# EAGLE design QFN48_ESP32-D0WD-V3_EXP.pac (EAGLE 9.6.2)
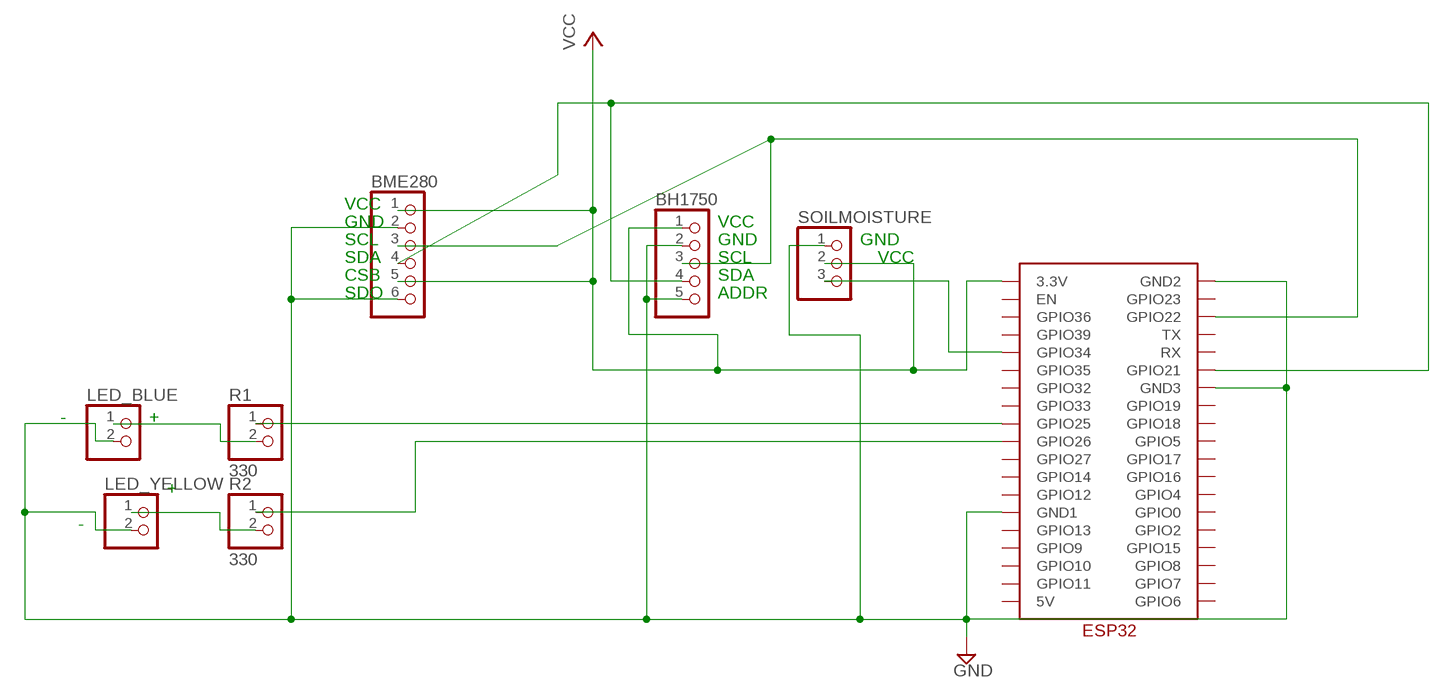
[diagram p0: schematic, sheet 1]

## Parts
BH1750  PINHD-1X5/90  [1X05/90]
BME280  PINHD-1X6/90  [1X06/90]
LED_BLUE  PINHD-1X2/90  [1X02/90]
LED_YELLOW  PINHD-1X2/90  [1X02/90]
R1  330  PINHD-1X2/90  [1X02/90]
R2  330  PINHD-1X2/90  [1X02/90]
SOILMOISTURE  PINHD-1X3/90  [1X03/90]
U$1  ESP32  [ESP32]

## Nets
3V3: BH1750.1 BME280.1 BME280.5 SOILMOISTURE.2 U$1.3.3V ; supply symbol labelled VCC
GND: BH1750.2 BH1750.5 BME280.2 BME280.6 LED_BLUE.2 LED_YELLOW.2 SOILMOISTURE.1 U$1.GND1 U$1.GND2 U$1.GND3
N$1: R1.1 U$1.GPIO25
N$2: LED_BLUE.1 R1.2
N$3: LED_YELLOW.1 R2.2
N$4: R2.1 U$1.GPIO26
SCL: BH1750.3 BME280.3 U$1.GPIO22
SDA: BH1750.4 BME280.4 U$1.GPIO21
SOIL_SIG: SOILMOISTURE.3 U$1.GPIO34
Unconnected: U$1.5V U$1.EN U$1.GPIO0 U$1.GPIO2 U$1.GPIO4 U$1.GPIO5 U$1.GPIO6 U$1.GPIO7 U$1.GPIO8 U$1.GPIO9 U$1.GPIO10 U$1.GPIO11 U$1.GPIO12 U$1.GPIO13 U$1.GPIO14 U$1.GPIO15 U$1.GPIO16 U$1.GPIO17 U$1.GPIO18 U$1.GPIO19 U$1.GPIO23 U$1.GPIO27 U$1.GPIO32 U$1.GPIO33 U$1.GPIO35 U$1.GPIO36 U$1.GPIO39 U$1.RX U$1.TX

## Notes on the sheet
- VCC
- GND | VCC
- SCL | GND | GND
- SDA | SCL | VCC
- CSB | SDA
- SDO | ADDR
- - | +
- +
- -

## Library data of the parts
BH1750 = pinhead:PINHD-1X5: PIN HEADER
BME280 = pinhead:PINHD-1X6: PIN HEADER
LED_BLUE LED_YELLOW R1 R2 = pinhead:PINHD-1X2: PIN HEADER
SOILMOISTURE = pinhead:PINHD-1X3: PIN HEADER
U$1 = ESP32:ESP32

## Net classes
0 default: width 0.305 mm, drill 0.508 mm, clearance 0.254 mm

## Board
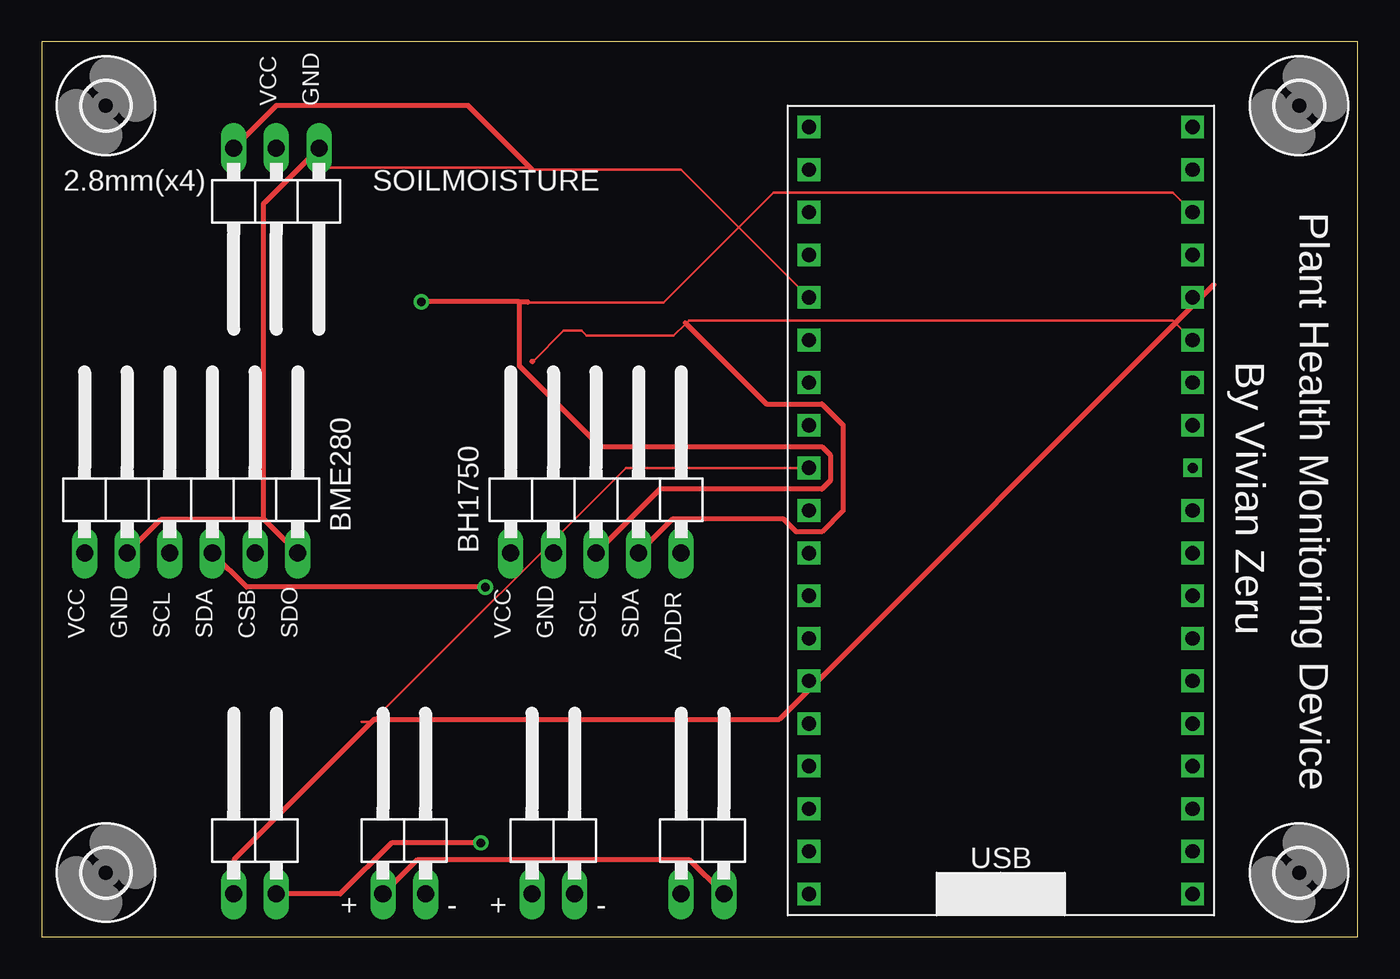
[diagram p1: board, top side]
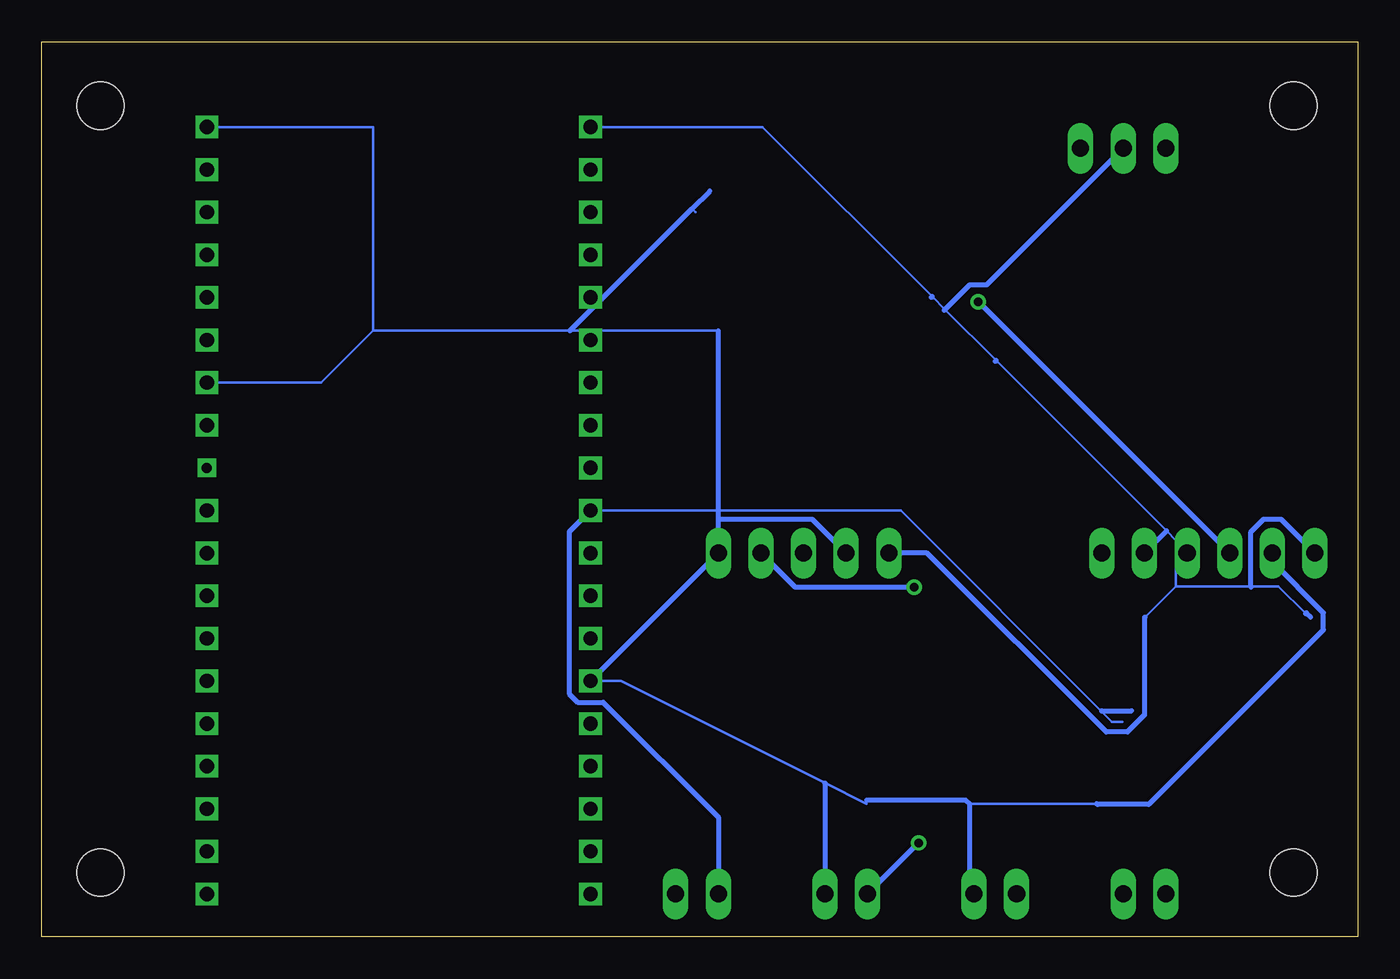
[diagram p2: board, bottom side, seen from below]

Size 78.41 x 53.33 mm. Coordinates in mm from the lower left corner, seen from the top.
Outline: 0,0 78.41,0 78.41,53.33 0,53.33 0,0
Copper layers (1*16): Top 0.035mm / dielectric 1.5mm / Bottom 0.035mm
Design rules "default": minimum track width 6mil, minimum drill 0.35mm, track to track 6mil, track to pad 6mil, pad to pad 6mil, via to via 6mil, smd to smd 6mil, copper to edge 40mil, drill to drill 6mil, minimum pad ring 10mil, minimum via ring 8mil, stop-mask expansion 4mil, vias tented up to drill 0mil, thermal gap 10mil

### Footprints (pad centres in the part's own frame; a part is rotated, then mirrored left to right if it is on the bottom)
1X05/90 = drill 1.016 long: 1 -5.08,-3.81; 2 -2.54,-3.81; 3 0,-3.81; 4 2.54,-3.81; 5 5.08,-3.81
1X06/90 = drill 1.016 long: 1 -6.35,-3.81; 2 -3.81,-3.81; 3 -1.27,-3.81; 4 1.27,-3.81; 5 3.81,-3.81; 6 6.35,-3.81
1X02/90 = drill 1.016 long: 1 -1.27,-3.81; 2 1.27,-3.81
1X03/90 = drill 1.016 long: 1 -2.54,-3.81; 2 0,-3.81; 3 2.54,-3.81
ESP32 = drill 0.85 square: 3.3V 1.27,46.99; 5V 1.27,1.27; EN 1.27,44.45; GND1 1.27,13.97; GND2 24.13,46.99; GND3 24.13,31.75; GPIO0 24.13,13.97; GPIO2 24.13,11.43; GPIO4 24.13,16.51; GPIO5 24.13,24.13; GPIO6 24.13,1.27; GPIO7 24.13,3.81; GPIO8 24.13,6.35; GPIO9 1.27,8.89; GPIO10 1.27,6.35; GPIO11 1.27,3.81; GPIO12 1.27,16.51; GPIO13 1.27,11.43; GPIO14 1.27,19.05; GPIO15 24.13,8.89; GPIO16 24.13,19.05; GPIO17 24.13,21.59; GPIO19 24.13,29.21; GPIO21 24.13,34.29; GPIO22 24.13,41.91; GPIO23 24.13,44.45; GPIO25 1.27,26.67; GPIO26 1.27,24.13; GPIO27 1.27,21.59; GPIO32 1.27,31.75; GPIO33 1.27,29.21; GPIO34 1.27,36.83; GPIO35 1.27,34.29; GPIO36 1.27,41.91; GPIO39 1.27,39.37; RX 24.13,36.83; TX 24.13,39.37 | drill 0.6 square: GPIO18 24.13,26.67
2,8 = hole 2.8: 0,0

### Placement (x,y rotation side)
BH1750  33.02,26.67 0 top
BME280  8.89,26.67 0 top
LED_BLUE  30.48,6.35 0 top
LED_YELLOW  21.59,6.35 0 top
R1  12.7,6.35 0 top
R2  39.37,6.35 0 top
SOILMOISTURE  13.97,43.18 180 top
U$1  44.45,1.27 0 top
U$2  [2,8]  3.81,49.53 0 top
U$3  [2,8]  3.81,3.81 0 top
U$4  [2,8]  74.93,3.81 0 top
U$5  [2,8]  74.93,49.53 0 top

### Tracks (layer width: path | path; a pad name or v marks a point on that pad's centre or on a via)
3V3
  Bottom 0.152: 2.9,19.05 3.1,19.25 4.72,20.88 6.35,20.88 10.82,20.88 | 12.65,19.05 10.82,20.88 | U$1.3.3V 35.46,48.26 25.35,38.15 24.59,37.39 21.54,34.34 11.38,24.18 10.82,23.62 10.82,20.88
  Bottom 0.305: 2.79,19.05 3.05,19.3 3.1,19.25 | 21.59,34.29 21.54,34.34 | 25.4,38.1 25.35,38.15 | BME280.1 4.57,24.89 5.59,24.89 6.35,24.13 6.35,20.88 6.35,20.83 | 11.38,24.18 BME280.5 | BH1750.1 25.65,22.86 14.99,12.19 13.72,12.19 12.7,13.21 12.7,19.05 12.65,19.05 | SOILMOISTURE.2 22.1,38.86 23.11,38.86 24.59,37.39 24.64,37.34
GND
  Top 0.305: 13.21,24.89 BME280.6 | 13.21,24.89 7.11,24.89 BME280.2 | SOILMOISTURE.1 13.21,43.69 13.21,24.89
  Bottom 0.152: 29.26,8.13 29.26,7.92 31.74,9.16 43.89,15.24 U$1.GND1 | 23.11,7.87 23.16,7.92 23.11,7.92 15.54,7.92 | 58.67,36.12 61.77,33.02 U$1.GND3 | 58.67,36.12 58.67,48.26 U$1.GND2 | 38.1,36.12 46.94,36.12 58.67,36.12 | 39.47,43.18 39.67,43.38
  Bottom 0.305: 29.26,8.13 23.37,8.13 23.11,7.87 | 23.11,7.87 23.11,2.79 LED_YELLOW.2 | 23.11,7.87 23.11,7.92 | 46.94,36.12 39.67,43.38 38.61,44.45 | BH1750.5 38.1,24.89 | 38.1,24.89 38.1,36.12 | U$1.GND1 BH1750.5 | 15.54,7.92 15.49,7.87 12.45,7.87 2.03,18.29 2.03,19.3 5.08,22.35 BME280.2 | BH1750.5 | LED_BLUE.2 31.75,9.14 31.74,9.16 | BH1750.2 32.51,24.89 38.1,24.89
N$1
  Top 0.152: 19.05,12.8 19.66,12.8 19.81,12.95 34.8,27.94 U$1.GPIO25
  Top 0.305: 69.85,38.86 43.94,12.95 19.81,12.95 11.43,4.57 R1.1
N$2  (via drill 0.51)
  Top 0.305: R1.2 17.78,2.54 20.83,5.59 v26.16,5.59
  Bottom 0.305: LED_BLUE.1 v26.16,5.59
N$3
  Top 0.305: LED_YELLOW.1 22.35,4.57 38.61,4.57 R2.2
N$4
  Bottom 0.152: 14.02,12.8 14.63,12.8 15.27,13.44 27.23,25.4 U$1.GPIO26
  Bottom 0.305: 13.46,13.46 15.24,13.46 15.27,13.44 | R2.1 38.1,7.11 44.96,13.97 46.48,13.97 46.99,14.48 46.99,24.13 U$1.GPIO26
SCL  (via drill 0.51)
  Top 0.152: 28.91,37.8 28.96,37.8 37.03,37.8 43.59,44.35 67.41,44.35 U$1.GPIO22
  Top 0.305: 28.45,37.85 28.96,37.85 28.96,37.8 | 28.45,37.85 v22.61,37.85 | BH1750.3 36.83,26.67 46.48,26.67 46.99,27.18 46.99,28.7 46.48,29.21 33.27,29.21 28.45,34.04 28.45,37.85
  Bottom 0.305: v22.61,37.85 BME280.3
SDA  (via drill 0.51)
  Top 0.152: 29.26,34.29 31.09,36.12 32.16,36.12 32.46,35.81 37.64,35.81 38.38,36.55 38.56,36.73 67.41,36.73 U$1.GPIO21
  Top 0.305: 29.21,34.29 29.26,34.29 | BME280.4 12.19,20.83 v26.42,20.83 | BH1750.4 37.59,24.89 44.2,24.89 44.96,24.13 46.48,24.13 47.75,25.4 47.75,30.48 46.48,31.75 43.18,31.75 38.38,36.55 38.35,36.58
  Bottom 0.305: v26.42,20.83 33.53,20.83 BH1750.4
SOIL_SIG
  Top 0.152: 16.51,45.82 29.11,45.82 29.21,45.72 38.1,45.72 U$1.GPIO34
  Top 0.305: 29.21,45.72 25.4,49.53 13.97,49.53 SOILMOISTURE.3

### Text on the board
tPlace: VCC | GND | 2.8mm(x4) | Plant Health Monitoring Device | By Vivian Zeru | VCC | GND | SCL | SDA | CSB | SDO | VCC | GND | SCL | SDA | ADDR | + | - | + | -